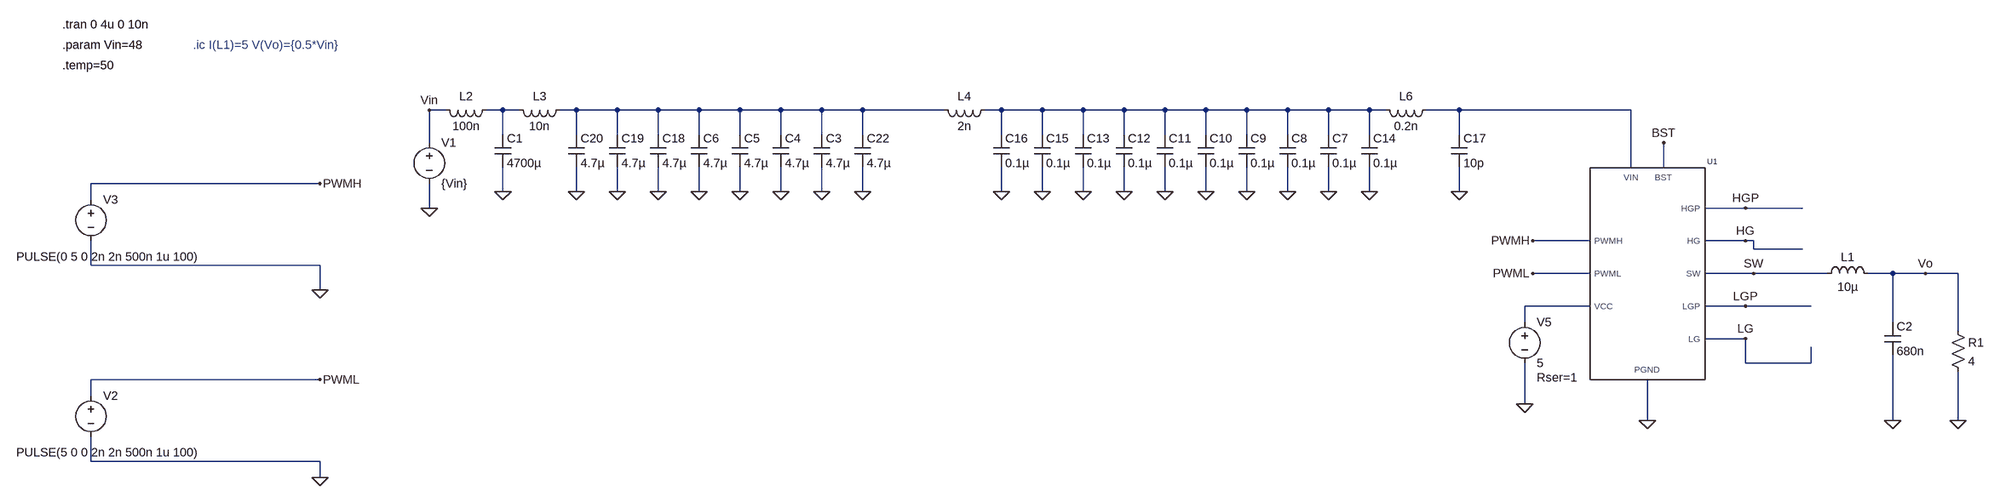
[diagram p0: schematic Buck_Test_ISG3204LA.asc]
Buck_Test_ISG3204LA.asc, the LTspice schematic file:
Version 4.1
SHEET 1 2952 1372
WIRE -160 400 -192 400
WIRE -48 400 -80 400
WIRE -16 400 -48 400
WIRE 96 400 64 400
WIRE 176 400 96 400
WIRE 256 400 176 400
WIRE 336 400 256 400
WIRE 416 400 336 400
WIRE 496 400 416 400
WIRE 576 400 496 400
WIRE 656 400 576 400
WIRE 912 400 656 400
WIRE 1024 400 992 400
WIRE 1104 400 1024 400
WIRE 1184 400 1104 400
WIRE 1264 400 1184 400
WIRE 1344 400 1264 400
WIRE 1424 400 1344 400
WIRE 1504 400 1424 400
WIRE 1584 400 1504 400
WIRE 1664 400 1584 400
WIRE 1744 400 1664 400
WIRE 1776 400 1744 400
WIRE 1920 400 1856 400
WIRE 2256 400 1920 400
WIRE -48 448 -48 400
WIRE 96 448 96 400
WIRE 176 448 176 400
WIRE 256 448 256 400
WIRE 336 448 336 400
WIRE 416 448 416 400
WIRE 496 448 496 400
WIRE 576 448 576 400
WIRE 656 448 656 400
WIRE 1024 448 1024 400
WIRE 1104 448 1104 400
WIRE 1184 448 1184 400
WIRE 1264 448 1264 400
WIRE 1344 448 1344 400
WIRE 1424 448 1424 400
WIRE 1504 448 1504 400
WIRE 1584 448 1584 400
WIRE 1664 448 1664 400
WIRE 1744 448 1744 400
WIRE 1920 448 1920 400
WIRE -192 464 -192 400
WIRE 2256 512 2256 400
WIRE 2320 512 2320 464
WIRE -1216 544 -1664 544
WIRE -48 560 -48 512
WIRE 96 560 96 512
WIRE 176 560 176 512
WIRE 256 560 256 512
WIRE 336 560 336 512
WIRE 416 560 416 512
WIRE 496 560 496 512
WIRE 576 560 576 512
WIRE 656 560 656 512
WIRE 1024 560 1024 512
WIRE 1104 560 1104 512
WIRE 1184 560 1184 512
WIRE 1264 560 1264 512
WIRE 1344 560 1344 512
WIRE 1424 560 1424 512
WIRE 1504 560 1504 512
WIRE 1584 560 1584 512
WIRE 1664 560 1664 512
WIRE 1744 560 1744 512
WIRE 1920 560 1920 512
WIRE -1664 576 -1664 544
WIRE -192 592 -192 544
WIRE 2480 592 2400 592
WIRE 2592 592 2480 592
WIRE 2176 656 2064 656
WIRE 2480 656 2400 656
WIRE 2496 656 2480 656
WIRE 2496 672 2496 656
WIRE 2592 672 2496 672
WIRE -1664 704 -1664 656
WIRE -1216 704 -1664 704
WIRE 2176 720 2064 720
WIRE 2496 720 2400 720
WIRE 2640 720 2496 720
WIRE 2768 720 2720 720
WIRE 2832 720 2768 720
WIRE 2896 720 2832 720
WIRE -1216 752 -1216 704
WIRE 2176 784 2048 784
WIRE 2480 784 2400 784
WIRE 2608 784 2480 784
WIRE 2048 816 2048 784
WIRE 2768 816 2768 720
WIRE 2896 832 2896 720
WIRE 2480 848 2400 848
WIRE 2480 896 2480 848
WIRE 2608 896 2608 864
WIRE 2608 896 2480 896
WIRE -1216 928 -1664 928
WIRE -1664 960 -1664 928
WIRE 2048 976 2048 896
WIRE 2288 1008 2288 928
WIRE 2768 1008 2768 880
WIRE 2896 1008 2896 912
WIRE -1664 1088 -1664 1040
WIRE -1216 1088 -1664 1088
WIRE -1216 1120 -1216 1088
FLAG 2288 1008 0
FLAG -192 592 0
FLAG 2896 1008 0
FLAG 2832 720 Vo
FLAG -192 400 Vin
FLAG -1216 928 PWML
FLAG 2064 720 PWML
FLAG 2064 656 PWMH
FLAG -1216 544 PWMH
FLAG -1216 1120 0
FLAG -1216 752 0
FLAG 2048 976 0
FLAG -48 560 0
FLAG 2768 1008 0
FLAG 2480 592 HGP
FLAG 2480 656 HG
FLAG 2480 784 LGP
FLAG 2480 848 LG
FLAG 2496 720 SW
FLAG 2320 464 BST
FLAG 1024 560 0
FLAG 1104 560 0
FLAG 1184 560 0
FLAG 1264 560 0
FLAG 1504 560 0
FLAG 1584 560 0
FLAG 1664 560 0
FLAG 1744 560 0
FLAG 1344 560 0
FLAG 1424 560 0
FLAG 1920 560 0
FLAG 96 560 0
FLAG 176 560 0
FLAG 256 560 0
FLAG 336 560 0
FLAG 416 560 0
FLAG 496 560 0
FLAG 576 560 0
FLAG 656 560 0
SYMBOL ind 2624 736 R270
WINDOW 0 32 56 VTop 2
WINDOW 3 5 56 VBottom 2
SYMATTR InstName L1
SYMATTR Value 10µ
SYMATTR SpiceLine Rser=1m
SYMBOL voltage -192 448 R0
WINDOW 123 0 0 Left 0
WINDOW 39 0 0 Left 0
SYMATTR InstName V1
SYMATTR Value {Vin}
SYMBOL voltage -1664 944 R0
WINDOW 3 -146 127 Left 2
WINDOW 123 0 0 Left 0
WINDOW 39 0 0 Left 0
SYMATTR Value PULSE(5 0 0 2n 2n 500n 1u 100)
SYMATTR InstName V2
SYMBOL voltage -1664 560 R0
WINDOW 3 -146 127 Left 2
WINDOW 123 0 0 Left 0
WINDOW 39 0 0 Left 0
SYMATTR Value PULSE(0 5 0 2n 2n 500n 1u 100)
SYMATTR InstName V3
SYMBOL voltage 2048 800 R0
WINDOW 123 0 0 Left 0
WINDOW 39 24 124 Left 2
SYMATTR SpiceLine Rser=1
SYMATTR InstName V5
SYMATTR Value 5
SYMBOL cap -64 448 R0
SYMATTR InstName C1
SYMATTR Value 4700µ
SYMATTR SpiceLine V=63 Irms=3.28 Rser=0.0373 Lser=19.843n mfg="W�rth Elektronik" pn="861010786015 WCAP-AIG8 35x25" type="Al electrolytic"
SYMBOL cap 2752 816 R0
SYMATTR InstName C2
SYMATTR Value 680n
SYMBOL res 2880 816 R0
SYMATTR InstName R1
SYMATTR Value 4
SYMBOL Innoscience\\ISG3204LA_LV2 2224 688 R0
SYMATTR InstName U1
SYMBOL ind -64 384 R90
WINDOW 0 5 56 VBottom 2
WINDOW 3 32 56 VTop 2
SYMATTR InstName L2
SYMATTR Value 100n
SYMATTR SpiceLine Rser=50m
SYMBOL ind 80 384 R90
WINDOW 0 5 56 VBottom 2
WINDOW 3 32 56 VTop 2
SYMATTR InstName L3
SYMATTR Value 10n
SYMATTR SpiceLine Rser=10m
SYMBOL ind 1008 384 R90
WINDOW 0 5 56 VBottom 2
WINDOW 3 32 56 VTop 2
SYMATTR InstName L4
SYMATTR Value 2n
SYMATTR SpiceLine Rser=5m
SYMBOL cap 1728 448 R0
SYMATTR InstName C14
SYMATTR Value 0.1µ
SYMATTR SpiceLine V=100 Irms=0 Rser=0.0115 Lser=371p mfg="W�rth Elektronik" pn="885012207128 WCAP-CSGP 0805" type="X7R"
SYMBOL ind 1872 384 R90
WINDOW 0 5 56 VBottom 2
WINDOW 3 32 56 VTop 2
SYMATTR InstName L6
SYMATTR Value 0.2n
SYMATTR SpiceLine Rser=1m
SYMBOL cap 1904 448 R0
SYMATTR InstName C17
SYMATTR Value 10p
SYMATTR SpiceLine Rser=0
SYMBOL cap 1648 448 R0
SYMATTR InstName C7
SYMATTR Value 0.1µ
SYMATTR SpiceLine V=100 Irms=0 Rser=0.0115 Lser=371p mfg="W�rth Elektronik" pn="885012207128 WCAP-CSGP 0805" type="X7R"
SYMBOL cap 1568 448 R0
SYMATTR InstName C8
SYMATTR Value 0.1µ
SYMATTR SpiceLine V=100 Irms=0 Rser=0.0115 Lser=371p mfg="W�rth Elektronik" pn="885012207128 WCAP-CSGP 0805" type="X7R"
SYMBOL cap 1488 448 R0
SYMATTR InstName C9
SYMATTR Value 0.1µ
SYMATTR SpiceLine V=100 Irms=0 Rser=0.0115 Lser=371p mfg="W�rth Elektronik" pn="885012207128 WCAP-CSGP 0805" type="X7R"
SYMBOL cap 1408 448 R0
SYMATTR InstName C10
SYMATTR Value 0.1µ
SYMATTR SpiceLine V=100 Irms=0 Rser=0.0115 Lser=371p mfg="W�rth Elektronik" pn="885012207128 WCAP-CSGP 0805" type="X7R"
SYMBOL cap 1328 448 R0
SYMATTR InstName C11
SYMATTR Value 0.1µ
SYMATTR SpiceLine V=100 Irms=0 Rser=0.0115 Lser=371p mfg="W�rth Elektronik" pn="885012207128 WCAP-CSGP 0805" type="X7R"
SYMBOL cap 1248 448 R0
SYMATTR InstName C12
SYMATTR Value 0.1µ
SYMATTR SpiceLine V=100 Irms=0 Rser=0.0115 Lser=371p mfg="W�rth Elektronik" pn="885012207128 WCAP-CSGP 0805" type="X7R"
SYMBOL cap 1168 448 R0
SYMATTR InstName C13
SYMATTR Value 0.1µ
SYMATTR SpiceLine V=100 Irms=0 Rser=0.0115 Lser=371p mfg="W�rth Elektronik" pn="885012207128 WCAP-CSGP 0805" type="X7R"
SYMBOL cap 1088 448 R0
SYMATTR InstName C15
SYMATTR Value 0.1µ
SYMATTR SpiceLine V=100 Irms=0 Rser=0.0115 Lser=371p mfg="W�rth Elektronik" pn="885012207128 WCAP-CSGP 0805" type="X7R"
SYMBOL cap 1008 448 R0
SYMATTR InstName C16
SYMATTR Value 0.1µ
SYMATTR SpiceLine V=100 Irms=0 Rser=0.0115 Lser=371p mfg="W�rth Elektronik" pn="885012207128 WCAP-CSGP 0805" type="X7R"
SYMBOL cap 640 448 R0
SYMATTR InstName C22
SYMATTR Value 4.7µ
SYMATTR SpiceLine V=100 Irms=0 Rser=0.0043 Lser=1.3n mfg="W�rth Elektronik" pn="885012214003 WCAP-CSGP 2220" type="X7R"
SYMBOL cap 560 448 R0
SYMATTR InstName C3
SYMATTR Value 4.7µ
SYMATTR SpiceLine V=100 Irms=0 Rser=0.0043 Lser=1.3n mfg="W�rth Elektronik" pn="885012214003 WCAP-CSGP 2220" type="X7R"
SYMBOL cap 480 448 R0
SYMATTR InstName C4
SYMATTR Value 4.7µ
SYMATTR SpiceLine V=100 Irms=0 Rser=0.0043 Lser=1.3n mfg="W�rth Elektronik" pn="885012214003 WCAP-CSGP 2220" type="X7R"
SYMBOL cap 400 448 R0
SYMATTR InstName C5
SYMATTR Value 4.7µ
SYMATTR SpiceLine V=100 Irms=0 Rser=0.0043 Lser=1.3n mfg="W�rth Elektronik" pn="885012214003 WCAP-CSGP 2220" type="X7R"
SYMBOL cap 320 448 R0
SYMATTR InstName C6
SYMATTR Value 4.7µ
SYMATTR SpiceLine V=100 Irms=0 Rser=0.0043 Lser=1.3n mfg="W�rth Elektronik" pn="885012214003 WCAP-CSGP 2220" type="X7R"
SYMBOL cap 240 448 R0
SYMATTR InstName C18
SYMATTR Value 4.7µ
SYMATTR SpiceLine V=100 Irms=0 Rser=0.0043 Lser=1.3n mfg="W�rth Elektronik" pn="885012214003 WCAP-CSGP 2220" type="X7R"
SYMBOL cap 160 448 R0
SYMATTR InstName C19
SYMATTR Value 4.7µ
SYMATTR SpiceLine V=100 Irms=0 Rser=0.0043 Lser=1.3n mfg="W�rth Elektronik" pn="885012214003 WCAP-CSGP 2220" type="X7R"
SYMBOL cap 80 448 R0
SYMATTR InstName C20
SYMATTR Value 4.7µ
SYMATTR SpiceLine V=100 Irms=0 Rser=0.0043 Lser=1.3n mfg="W�rth Elektronik" pn="885012214003 WCAP-CSGP 2220" type="X7R"
TEXT -1720 232 Left 2 !.tran 0 4u 0 10n
TEXT -1464 272 Left 2 ;.ic I(L1)=5 V(Vo)={0.5*Vin}
TEXT -1720 272 Left 2 !.param Vin=48
TEXT -1720 312 Left 2 !.temp=50

The netlist it stands for:
* Buck_Test_ISG3204LA.asc
L1 SW Vo 10µ Rser=1m
V1 Vin 0 {Vin}
V2 PWML 0 PULSE(5 0 0 2n 2n 500n 1u 100)
V3 PWMH 0 PULSE(0 5 0 2n 2n 500n 1u 100)
V5 N005 0 5 Rser=1
C1 N001 0 4700µ V=63 Irms=3.28 Rser=0.0373 Lser=19.843n mfg="W�rth Elektronik" pn="861010786015 WCAP-AIG8 35x25" type="Al electrolytic"
C2 Vo 0 680n
R1 Vo 0 4
X§U1 N005 PWML PWMH N004 BST HGP HG SW LGP LG 0 ISG3204LA_LV2  ; pins VCC PWML PWMH VIN BST HGP HG SW LGP LG PGND
L2 N001 Vin 100n Rser=50m
L3 N002 N001 10n Rser=10m
L4 N003 N002 2n Rser=5m
C14 N003 0 0.1µ V=100 Irms=0 Rser=0.0115 Lser=371p mfg="W�rth Elektronik" pn="885012207128 WCAP-CSGP 0805" type="X7R"
L6 N004 N003 0.2n Rser=1m
C17 N004 0 10p Rser=0
C7 N003 0 0.1µ V=100 Irms=0 Rser=0.0115 Lser=371p mfg="W�rth Elektronik" pn="885012207128 WCAP-CSGP 0805" type="X7R"
C8 N003 0 0.1µ V=100 Irms=0 Rser=0.0115 Lser=371p mfg="W�rth Elektronik" pn="885012207128 WCAP-CSGP 0805" type="X7R"
C9 N003 0 0.1µ V=100 Irms=0 Rser=0.0115 Lser=371p mfg="W�rth Elektronik" pn="885012207128 WCAP-CSGP 0805" type="X7R"
C10 N003 0 0.1µ V=100 Irms=0 Rser=0.0115 Lser=371p mfg="W�rth Elektronik" pn="885012207128 WCAP-CSGP 0805" type="X7R"
C11 N003 0 0.1µ V=100 Irms=0 Rser=0.0115 Lser=371p mfg="W�rth Elektronik" pn="885012207128 WCAP-CSGP 0805" type="X7R"
C12 N003 0 0.1µ V=100 Irms=0 Rser=0.0115 Lser=371p mfg="W�rth Elektronik" pn="885012207128 WCAP-CSGP 0805" type="X7R"
C13 N003 0 0.1µ V=100 Irms=0 Rser=0.0115 Lser=371p mfg="W�rth Elektronik" pn="885012207128 WCAP-CSGP 0805" type="X7R"
C15 N003 0 0.1µ V=100 Irms=0 Rser=0.0115 Lser=371p mfg="W�rth Elektronik" pn="885012207128 WCAP-CSGP 0805" type="X7R"
C16 N003 0 0.1µ V=100 Irms=0 Rser=0.0115 Lser=371p mfg="W�rth Elektronik" pn="885012207128 WCAP-CSGP 0805" type="X7R"
C22 N002 0 4.7µ V=100 Irms=0 Rser=0.0043 Lser=1.3n mfg="W�rth Elektronik" pn="885012214003 WCAP-CSGP 2220" type="X7R"
C3 N002 0 4.7µ V=100 Irms=0 Rser=0.0043 Lser=1.3n mfg="W�rth Elektronik" pn="885012214003 WCAP-CSGP 2220" type="X7R"
C4 N002 0 4.7µ V=100 Irms=0 Rser=0.0043 Lser=1.3n mfg="W�rth Elektronik" pn="885012214003 WCAP-CSGP 2220" type="X7R"
C5 N002 0 4.7µ V=100 Irms=0 Rser=0.0043 Lser=1.3n mfg="W�rth Elektronik" pn="885012214003 WCAP-CSGP 2220" type="X7R"
C6 N002 0 4.7µ V=100 Irms=0 Rser=0.0043 Lser=1.3n mfg="W�rth Elektronik" pn="885012214003 WCAP-CSGP 2220" type="X7R"
C18 N002 0 4.7µ V=100 Irms=0 Rser=0.0043 Lser=1.3n mfg="W�rth Elektronik" pn="885012214003 WCAP-CSGP 2220" type="X7R"
C19 N002 0 4.7µ V=100 Irms=0 Rser=0.0043 Lser=1.3n mfg="W�rth Elektronik" pn="885012214003 WCAP-CSGP 2220" type="X7R"
C20 N002 0 4.7µ V=100 Irms=0 Rser=0.0043 Lser=1.3n mfg="W�rth Elektronik" pn="885012214003 WCAP-CSGP 2220" type="X7R"
.tran 0 4u 0 10n
* .ic I(L1)=5 V(Vo)={0.5*Vin}
.param Vin=48
.temp=50
.lib ISG3204LA_LV2_LTspice.lib
.backanno
.end